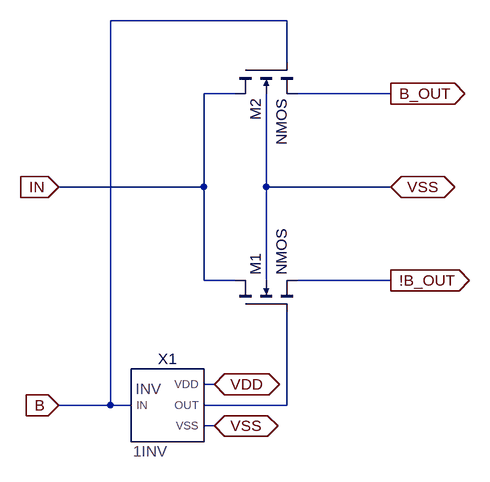
[diagram p0: schematic 2WAY_MUX.asc]
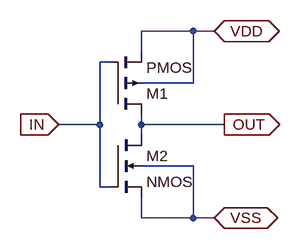
[diagram p1: sub-circuit 1inv.asc]
2WAY_MUX.asc, the LTspice schematic file:
Version 4
SHEET 1 1108 680
WIRE 176 -224 -96 -224
WIRE 176 -160 176 -224
WIRE 96 -112 48 -112
WIRE 336 -112 192 -112
WIRE 48 32 48 -112
WIRE 48 32 -176 32
WIRE 144 32 144 -112
WIRE 336 32 144 32
WIRE 48 176 48 32
WIRE 96 176 48 176
WIRE 144 176 144 32
WIRE 336 176 192 176
WIRE 64 336 48 336
WIRE -96 368 -96 -224
WIRE -96 368 -176 368
WIRE -64 368 -96 368
WIRE 176 368 176 224
WIRE 176 368 48 368
WIRE 64 400 48 400
FLAG 336 32 VSS
IOPIN 336 32 BiDir
FLAG 64 336 VDD
IOPIN 64 336 BiDir
FLAG 64 400 VSS
IOPIN 64 400 BiDir
FLAG -176 368 B
IOPIN -176 368 In
FLAG -176 32 IN
IOPIN -176 32 In
FLAG 336 -112 B_OUT
IOPIN 336 -112 Out
FLAG 336 176 !B_OUT
IOPIN 336 176 Out
SYMBOL nmos4 96 224 R270
SYMATTR InstName M1
SYMATTR Value2 l=110nM w=300nM
SYMBOL nmos4 96 -160 M90
SYMATTR InstName M2
SYMATTR Value2 l=110n w=180n
SYMBOL 1INV -16 368 R0
SYMATTR InstName X1

1inv.asc, the sub-circuit schematic file:
Version 4
SHEET 1 880 680
WIRE 224 -16 144 -16
WIRE 256 -16 224 -16
WIRE 144 16 144 -16
WIRE 96 32 80 32
WIRE 224 64 224 -16
WIRE 224 64 144 64
WIRE 80 128 80 32
WIRE 80 128 16 128
WIRE 144 128 144 112
WIRE 272 128 144 128
WIRE 144 144 144 128
WIRE 224 192 144 192
WIRE 80 224 80 128
WIRE 96 224 80 224
WIRE 144 272 144 240
WIRE 224 272 224 192
WIRE 224 272 144 272
WIRE 256 272 224 272
FLAG 16 128 IN
IOPIN 16 128 In
FLAG 272 128 OUT
IOPIN 272 128 Out
FLAG 256 -16 VDD
IOPIN 256 -16 BiDir
FLAG 256 272 VSS
IOPIN 256 272 BiDir
SYMBOL pmos4 96 112 M180
SYMATTR InstName M1
SYMATTR Value2 l=110nM w=180nM
SYMBOL nmos4 96 144 R0
SYMATTR InstName M2
SYMATTR Value2 l=110nM w=180nM

The netlist it stands for:
* 2WAY_MUX.asc
M1 IN N001 !B_OUT VSS NMOS l=110nM w=300nM
M2 IN B B_OUT VSS NMOS l=110n w=180n
XX1 B N001 VDD VSS 1inv

* block symbol definitions
.subckt 1inv IN OUT VDD VSS
M1 OUT IN VDD VDD PMOS l=110nM w=180nM
M2 OUT IN VSS VSS NMOS l=110nM w=180nM
.ends 1inv

.model NMOS NMOS
.model PMOS PMOS
.lib standard.mos
.backanno
.end